# Altium schematic sheet Buck120W_Schematic.SchDoc
size A4
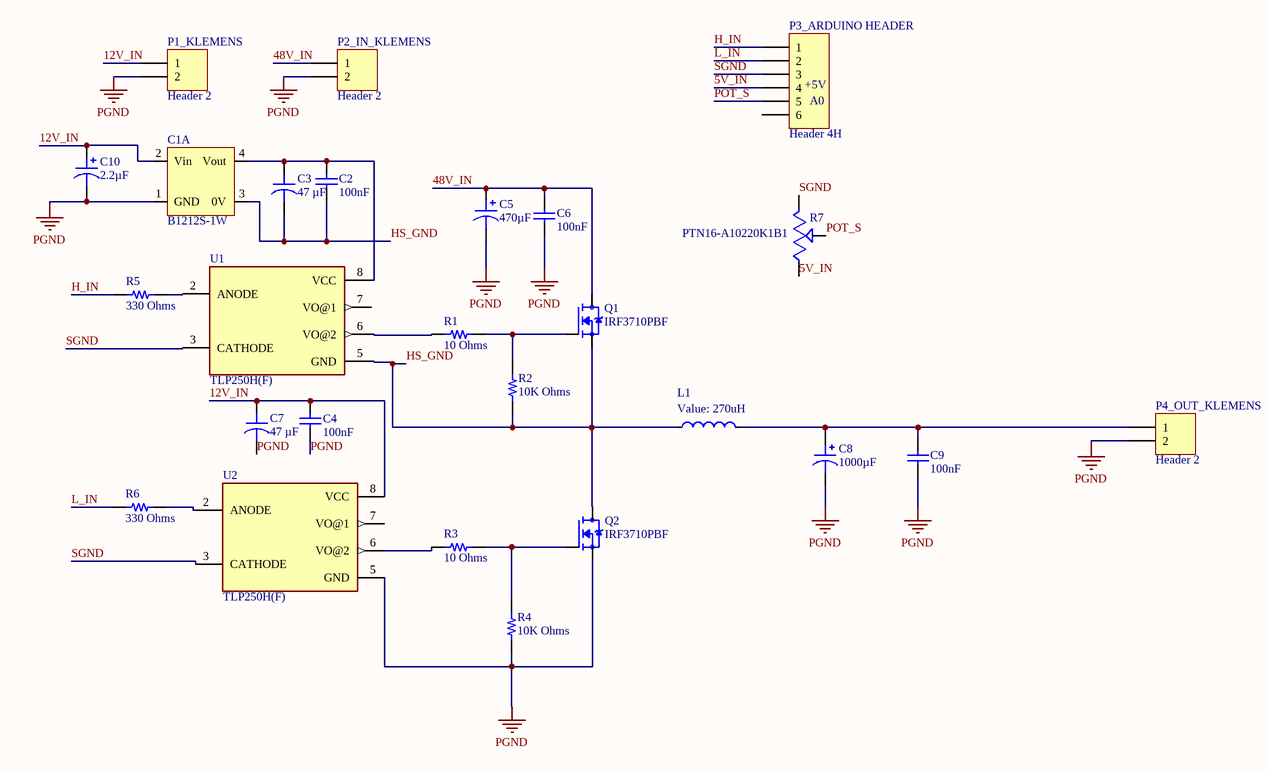
[diagram p0: Buck120W_Schematic.SchDoc]

## Parts
C1  B1212S-1W  [CONV_VIBLSD1-S12-S12-SIP]  (part A of 3)
C2  100nF  [PCBComponent_1H]
C3  47 µF  [CAP 8X12.5]
C4  100nF  [PCBComponent_1H]
C5  470µF  [CAP 16X33]
C6  100nF  [PCBComponent_1H]
C7  47 µF  [CAP 8X12.5]
C8  1000µF  [CAP 16X26.5]
C9  100nF  [PCBComponent_1H]
C10  2.2µF  [CAP 8X12.5]
L1  value 270uH  [Taiyo Yuden - Power Inductor, 5050WK]  (hidden comment: Inductor)
P1_KLEMENS  Header 2  [PCBComponent_1K]
P2_IN_KLEMENS  Header 2  [PCBComponent_1K]
P3_ARDUINO_HEADER  Header 4H  [HEADER6H]
P4_OUT_KLEMENS  Header 2  [PCBComponent_1K]
Q1  IRF3710PBF  [TO254P1041X444X1930-3]
Q2  IRF3710PBF  [TO254P1041X444X1930-3]
R1  10 Ohms  [AXIAL-0.4]
R2  10K Ohms  [AXIAL-0.4]
R3  10 Ohms  [AXIAL-0.4]
R4  10K Ohms  [AXIAL-0.4]
R5  330 Ohms  [AXIAL-0.4]
R6  330 Ohms  [AXIAL-0.4]
R7  PTN16-A10220K1B1  [POT_PTN16-A10220K1B1]
U1  TLP250H(F)  [DIP1016W50P254L966H380Q8P]
U2  TLP250H(F)  [DIP1016W50P254L966H380Q8P]

## Nets
PGND: C1.1(GND) C4.1 C5.2 C6.1 C7.2 C8.2 C9.2 C10.2 P1_KLEMENS.2 P2_IN_KLEMENS.2 P4_OUT_KLEMENS.2 Q2.3(S) R4.1 U2.5(GND)
5V_IN: P3_ARDUINO_HEADER.4 R7.1
12V_IN: C1.2(Vin) C4.2 C7.1 C10.1 P1_KLEMENS.1 U2.8(VCC)
48V_IN: C5.1 C6.2 P2_IN_KLEMENS.1 Q1.2(D)
H_IN: P3_ARDUINO_HEADER.1 R5.1
HS_GND: C1.3(0V) C2.1 C3.2 L1.1 Q1.3(S) Q2.2(D) R2.1 U1.5(GND)
L_IN: P3_ARDUINO_HEADER.2 R6.1
POT_S: P3_ARDUINO_HEADER.5 R7.2
SGND: P3_ARDUINO_HEADER.3 R7.3 U1.3(CATHODE) U2.3(CATHODE)
NetC1_4: C1.4(Vout) C2.2 C3.1 U1.8(VCC)
NetC8_1: C8.1 C9.1 L1.2 P4_OUT_KLEMENS.1
NetQ1_1: Q1.1(G) R1.2 R2.2
NetQ2_1: Q2.1(G) R3.2 R4.2
NetR1_1: R1.1 U1.6(VO@2)
NetR3_1: R3.1 U2.6(VO@2)
NetR5_2: R5.2 U1.2(ANODE)
NetR6_2: R6.2 U2.2(ANODE)

Not connected (* = marked no-connect by the designer): P3_ARDUINO_HEADER 6; U1 7(VO@1); U2 7(VO@1)

## Notes on the sheet
- (near P3_ARDUINO_HEADER) +5V
- (near P3_ARDUINO_HEADER) A0

## Library data of the parts
C1 = B1212S-1W: 12V--12V, isolated
C2 C4 C6 C9 = CAP 100NF 100V: Published: 8-Jun-2000; LatestRevisionDate: 17-Jul-2002; LatestRevisionNote: Re-released for DXP Platform.; PackageReference: RAD-0.3; Publisher: Altium Limited; PackageDescription: Radial Cap, Thru-Hole; 2 Leads; 0.3 in Pin Spacing
C3 C7 = CAP 47UF 35V: CAP ALUM 47UF 20% 35V RADIAL; Part Number: UKL1V470MPD1TD; manufacturer: Nichicon; Lifetime @ Temp.: 2000 Hrs @ 85°C; Polarization: Polar; Ripple Current @ High Frequency: 380 mA @ 10 kHz; Ripple Current @ Low Frequency: 190 mA @ 120 Hz; Applications: General Purpose; Capacitance: 47 µF; componentlink1description: Datasheet; componentlink1url: http://nichicon-us.com/english/products/pdfs/e-ukl.pdf; componentlink2description: DigiKey Link; componentlink2url: https://www.digikey.com/en/products/detail/nichicon/UKL1V470MPD1TD/4318008; Device Package: Radial, Can; Height - Seated (Max): 0.492" (12.50mm); lastupdated: 3.06.2024 20:06:12; Lead Spacing: 0.138" (3.50mm); Lifecycle Status: Active; Minimum Order: 1; Mounting Type: Through Hole; Operating Temperature: -40°C ~ 85°C; Package / Case: Radial, Can; packaging: TapeAndBox; partid: 7194; Part Status: Active; price: 0.16; series: UKL; Size / Dimension: 0.315" Dia (8.00mm); Supplier 1: DigiKey; Supplier Part Number 1: 493-10519-1-ND; Tolerance: ±20%; value: 47 µF; Voltage - Rated: 35 V
C5 = CAP 470UF 100V: 100V 470UF 20% HIGH TEMP LEADED; Part Number: UBY2A471MHL; manufacturer: Nichicon; ESR (Equivalent Series Resistance): 34mOhm @ 100kHz; Lifetime @ Temp.: 3000 Hrs @ 135°C; Polarization: Polar; Ripple Current @ High Frequency: 3.86A @ 100kHz; Ripple Current @ Low Frequency: 1.93A @ 120Hz; Applications: Automotive; Capacitance: 470µF; componentlink1description: Datasheet; componentlink1url: http://nichicon-us.com/english/products/pdfs/e-uby.pdf; componentlink2description: DigiKey Link; componentlink2url: http://digikey.com/product-detail/en/nichicon/UBY2A471MHL/493-17786-ND/9452720; Device Package: Radial, Can; Height - Seated (Max): 1.299" (33.00mm); lastupdated: 2.09.2020 01:33:02; Lead Spacing: 0.295" (7.50mm); Lifecycle Status: Active; Minimum Order: 1; Mounting Type: Through Hole; Operating Temperature: -40°C ~ 135°C; Package / Case: Radial, Can; packaging: Bulk; partid: 17477; Part Status: Active; price: 3.37; series: UBY; Size / Dimension: 0.630" Dia (16.00mm); Supplier 1: DigiKey; Supplier Part Number 1: 493-17786-ND; Tolerance: ±20%; value: 470µF; Voltage - Rated: 100V
C8 = CAP 1000 UF 50V: 50V 1000UF 20% HIGH TEMP LEADED; Part Number: UBY1J102MHL; manufacturer: Nichicon; ESR (Equivalent Series Resistance): 39mOhm @ 100kHz; Lifetime @ Temp.: 3000 Hrs @ 135°C; Polarization: Polar; Ripple Current @ High Frequency: 2.94A @ 100kHz; Ripple Current @ Low Frequency: 1.764A @ 120Hz; Voltage - Rated: 63V; Applications: Automotive; Capacitance: 1000µF; componentlink1description: Datasheet; componentlink1url: http://nichicon-us.com/english/products/pdfs/e-uby.pdf; componentlink2description: DigiKey Link; componentlink2url: http://digikey.com/product-detail/en/nichicon/UBY1J102MHL/493-17734-ND/9452668; Device Package: Radial, Can; Height - Seated (Max): 1.043" (26.50mm); lastupdated: 2.09.2020 01:32:52; Lead Spacing: 0.295" (7.50mm); Lifecycle Status: Active; Minimum Order: 1; Mounting Type: Through Hole; Operating Temperature: -40°C ~ 135°C; Package / Case: Radial, Can; packaging: Bulk; partid: 16723; Part Status: Active; price: 2.63; series: UBY; Size / Dimension: 0.630" Dia (16.00mm); Supplier 1: DigiKey; Supplier Part Number 1: 493-17734-ND; Tolerance: ±20%; value: 1000µF
C10 = CAP 2.2 UF: CAP 2.2 UF 20% 250 V; Part Number: 860131173002; manufacturer: Würth Elektronik; Lifetime @ Temp.: 1000 Hrs @ 125°C; Polarization: Polar; Ripple Current @ High Frequency: 71.4mA @ 100kHz; Ripple Current @ Low Frequency: 42mA @ 120Hz; Voltage - Rated: 250V; Applications: General Purpose; Capacitance: 2.2µF; componentlink1description: Datasheet; componentlink1url: https://katalog.we-online.de/pbs/datasheet/860131173002.pdf; componentlink2description: DigiKey Link; componentlink2url: http://digikey.com/product-detail/en/w-rth-elektronik/860131173002/732-9390-1-ND/5729328; Device Package: Radial, Can; Height - Seated (Max): 0.492" (12.50mm); lastupdated: 4.09.2020 01:05:47; Lead Spacing: 0.098" (2.50mm); Lifecycle Status: Active; Minimum Order: 1; Mounting Type: Through Hole; Operating Temperature: -25°C ~ 125°C; Package / Case: Radial, Can; packaging: TapeAndBox; partid: 20330; Part Status: Active; price: 0.20; series: WCAP-ATET; Size / Dimension: 0.248" Dia (6.30mm); Supplier 1: DigiKey; Supplier Part Number 1: 732-9390-1-ND; Tolerance: ±20%; value: 2.2µF
L1 = IND 270UH: Inductor, Power, 270UH 8A; ComponentLink1Description: Datasheet; ComponentLink1URL: *; ComponentLink2Description: Supplier Link; ComponentLink2URL: *; Manufacturer Part Number: *; Supplier: *; Supplier Part Number: *; Manufacturer: *; Operating Temperature, Min: *℃; Operating Temperature, Max: *℃; Quantity, Min: *; Quantity, Max: *; Price, Min: *; Price, Max: *; Supplier Currency: *; Supplier Link: *; Component Type: Power Inductor; Component Category: Inductor
P1_KLEMENS P2_IN_KLEMENS P4_OUT_KLEMENS = Header 2: Header, 2-Pin; LatestRevisionDate: 17-Jul-2002; LatestRevisionNote: Re-released for DXP Platform.; Publisher: Altium Limited
P3_ARDUINO_HEADER = Header 6H: Header, 4-Pin, Right Angle; LatestRevisionDate: 17-Jul-2002; LatestRevisionNote: Re-released for DXP Platform.; Publisher: Altium Limited
Q1 Q2 = IRF3710PBF: N-MOSFET 100V 57A 23mR; MF: Infineon Technologies; MP: IRF530NPBF; Purchase-URL: https://pricing.snapeda.com/search/part/IRF530NPBF/?ref=eda; Check_prices: https://www.snapeda.com/parts/IRF530NPBF/Infineon+Technologies/view-part/?ref=eda; SnapEDA_Link: https://www.snapeda.com/parts/IRF530NPBF/Infineon+Technologies/view-part/?ref=snap; Price: None; Availability: In Stock; Package: TO-220 Infineon; Value: *
R1 R3 = Resistor10: RES 10 1/4W; Part Number: TLRZ2ATTD; Manufacturer: KOA Speer Electronics, Inc.; Resistance: 0 Ohms; Tolerance: Jumper; ComponentLink1Description: Datasheet; ComponentLink1URL: http://www.koaspeer.com/catimages/Products/TLRZ/TLRZ.pdf; ComponentLink2Description: DigiKey Link; ComponentLink2URL: https://www.digikey.com/en/products/detail/koa-speer-electronics-inc/TLRZ2ATTD/9845494; Composition: Metal Element; Device Package: 0805 (2012 Metric); Features: Automotive AEC-Q200, Current Sense; Height - Seated (Max): 0.022" (0.55mm); LastUpdated: 8.02.2024 21:02:39; Lifecycle Status: Active; Minimum Order: 1; Number of Terminations: 2; Operating Temperature: -55°C ~ 170°C; Package / Case: 0805 (2012 Metric); Packaging: TapeAndReel; PartId: 27685; Part Status: Active; Price: 0.08; Ratings: AEC-Q200; Series: TLRZ; Size / Dimension: 0.079" L x 0.049" W (2.00mm x 1.25mm); Supplier 1: DigiKey; Supplier Part Number 1: 2019-TLRZ2ATTDCT-ND; Supplier Device Package: 0805; Value: 10 Ohms
R2 R4 = Resistor10K: RES 10K 1/4W; Part Number: TLRZ2ATTD; Manufacturer: KOA Speer Electronics, Inc.; Resistance: 0 Ohms; Tolerance: Jumper; ComponentLink1Description: Datasheet; ComponentLink1URL: http://www.koaspeer.com/catimages/Products/TLRZ/TLRZ.pdf; ComponentLink2Description: DigiKey Link; ComponentLink2URL: https://www.digikey.com/en/products/detail/koa-speer-electronics-inc/TLRZ2ATTD/9845494; Composition: Metal Element; Device Package: 0805 (2012 Metric); Features: Automotive AEC-Q200, Current Sense; Height - Seated (Max): 0.022" (0.55mm); LastUpdated: 8.02.2024 21:02:39; Lifecycle Status: Active; Minimum Order: 1; Number of Terminations: 2; Operating Temperature: -55°C ~ 170°C; Package / Case: 0805 (2012 Metric); Packaging: TapeAndReel; PartId: 27685; Part Status: Active; Price: 0.08; Ratings: AEC-Q200; Series: TLRZ; Size / Dimension: 0.079" L x 0.049" W (2.00mm x 1.25mm); Supplier 1: DigiKey; Supplier Part Number 1: 2019-TLRZ2ATTDCT-ND; Supplier Device Package: 0805; Value: 10K Ohms
R7 = PTN16-A10220K1B1: 16.5 mm, Horizontal, Linear, 10 kÎ©, Through Hole, Knurled Shaft Single Section Rotary Potentiometer; MF: Same Sky; SnapEDA_Link: https://www.snapeda.com/parts/PTN16-A10220K1B1/Same+Sky/view-part/?ref=snap; Package: Package; Value: *; MP: PTN16-A10220K1B1; Check_prices: https://www.snapeda.com/parts/PTN16-A10220K1B1/Same+Sky/view-part/?ref=eda
U1 U2 = TLP250H(F): 3750Vrms 2.5A  1 Channel 40kV/Âµs 8-DIP Logic Output Optoisolator - Push-Pull, Totem Pole; MF: Toshiba; SnapEDA_Link: https://www.snapeda.com/parts/TLP250H(F)/Toshiba/view-part/?ref=snap; Package: DIP-8 Toshiba; Value: *; MP: TLP250H(F); Check_prices: https://www.snapeda.com/parts/TLP250H(F)/Toshiba/view-part/?ref=eda